# EAGLE design comperator_3dprinterV2 (EAGLE 8.3.0)
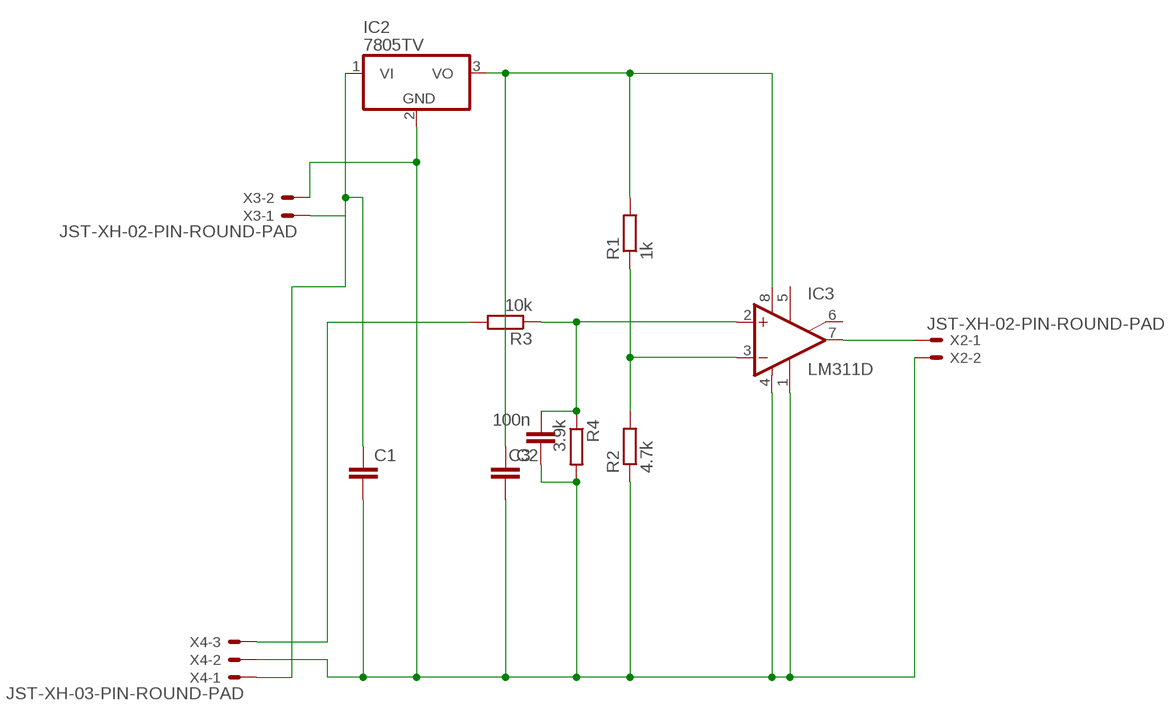
[diagram p0: schematic, sheet 1]

## Parts
C1  C2.5/2  [C2.5-2]
C2  C2.5/2  [C2.5-2]
C3  100n  C2.5/2  [C2.5-2]
IC2  7805TV  [TO220V]
IC3  LM311D  [SO08]
R1  1k  R-EU_0207/7  [0207/7]
R2  4.7k  R-EU_0207/7  [0207/7]
R3  10k  R-EU_0207/7  [0207/7]
R4  3.9k  R-EU_0207/7  [0207/7]
X2  JST-XH-02-PIN-ROUND-PAD  [JST-XH-02-PACKAGE-ROUND-PAD]
X3  JST-XH-02-PIN-ROUND-PAD  [JST-XH-02-PACKAGE-ROUND-PAD]
X4  JST-XH-03-PIN-ROUND-PAD  [JST-XH-03-PACKAGE-ROUND-PAD]

## Nets
GND: C1.2 C2.2 C3.1 IC2.2(GND) IC3.1(GND) IC3.4(V-) R2.1 R4.2 X2.2 X3.2 X4.2
N$1: IC3.7(OUT) X2.1
N$3: R3.2 X4.3
N$4: C2.1 IC2.3(VO) IC3.8(V+) R1.2
N$5: C3.2 IC3.2(+IN) R3.1 R4.1
N$7: IC3.3(-IN) R1.1 R2.2
VCC: C1.1 IC2.1(VI) X3.1 X4.1
Unconnected: IC3.5(ON) IC3.6(ON/STR)

## Library data of the parts
C1-C3 = capacitor-wima:C: CAPACITOR naming: grid - package width
IC2 = linear:78*: Positive VOLTAGE REGULATOR Source: http://cache.national.com/ds/LM/LM78L05.pdf http://www.fairchildsemi.com/ds/LM/LM7805.pdf
IC3 = linear2:LM311: COMPARATOR
R1-R4 = resistor:R-EU_: RESISTOR, European symbol
X2 X3 = Rembrandt Electronics - JST XH Connectors v1-0:JST-XH-02-PIN: JST XH Connector 2 Pin Wire to board connector. Pitch: 2,54 mm, (0.100") Number of pins: 2 Created by Rembrandt Electronics www.rembrandtelectronics.com
X4 = Rembrandt:JST-XH-03-PIN: JST XH Connector 2 Pin Wire to board connector. Pitch: 2,54 mm, (0.100") Number of pins: 3 Created by Rembrandt Electronics www.rembrandtelectronics.com

## Board
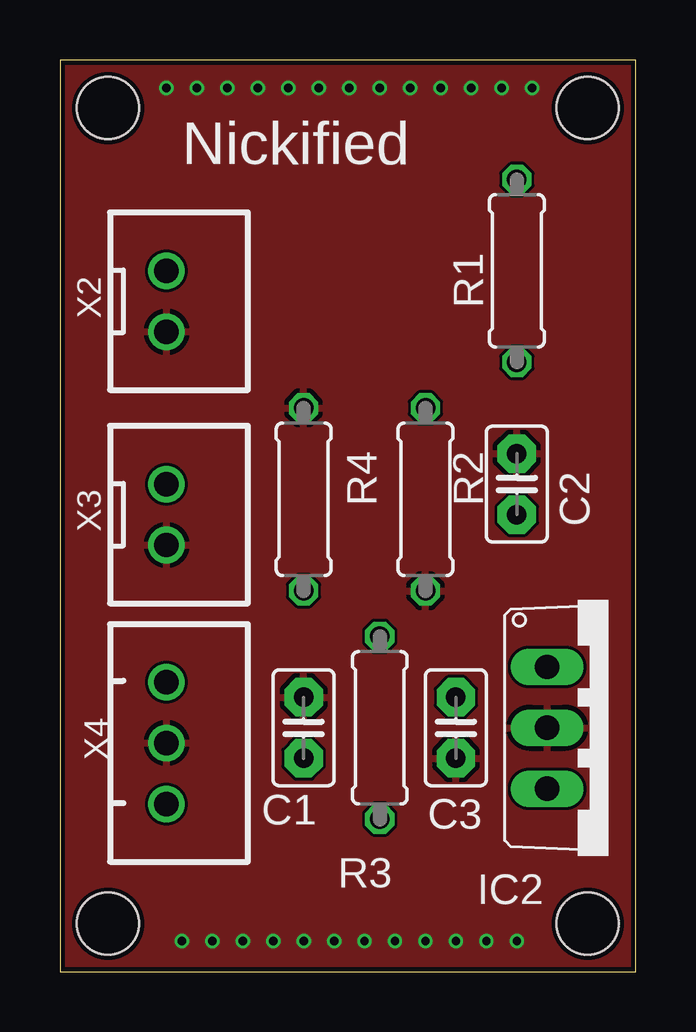
[diagram p1: board, top side]
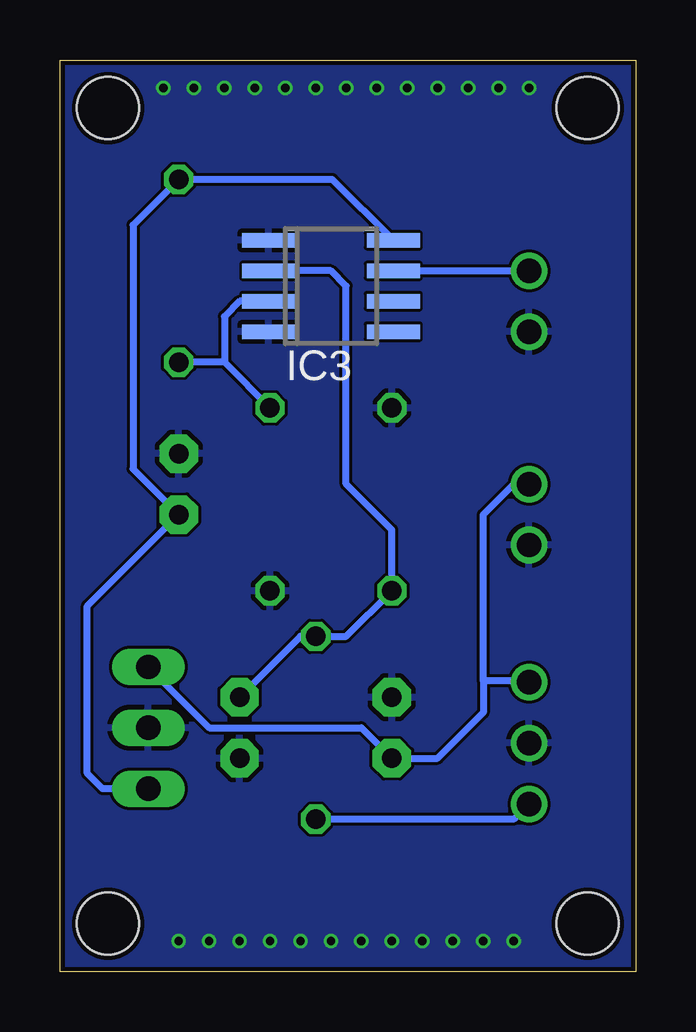
[diagram p2: board, bottom side, seen from below]

Size 24 x 38 mm. Coordinates in mm from the lower left corner, seen from the top.
Outline: 0,0 24,0 24,38 0,38 0,0
Copper layers (1*16): Top 0.018mm / dielectric 1.55mm / Bottom 0.018mm
Design rules "Multi-CB_2L_125um-Tracks_OL35um": minimum track width 0.125mm, minimum drill 0.2mm, track to track 0.125mm, track to pad 0.125mm, pad to pad 0.125mm, via to via 0.125mm, smd to smd 0mil, copper to edge 0.2mm, drill to drill 0.2mm, minimum pad ring 0.125mm, minimum via ring 0.125mm, stop-mask expansion 2mil, vias tented up to drill 0.45mm, thermal gap 0.2mm
Holes 2.6 mm at 2,36 22,36 22,2 2,2

### Footprints (pad centres in the part's own frame; a part is rotated, then mirrored left to right if it is on the bottom)
C2.5-2 = drill 0.813 pad 1.6 octagon: 1 -1.27,0; 2 1.27,0
TO220V = drill 1.016 long: 1 -2.54,-2.54; 2 0,-2.54; 3 2.54,-2.54
SO08 = smd 0.6 x 2.2: 1 -1.905,-2.6; 2 -0.635,-2.6; 3 0.635,-2.6; 4 1.905,-2.6; 5 1.905,2.6; 6 0.635,2.6; 7 -0.635,2.6; 8 -1.905,2.6
0207/7 = drill 0.813 octagon: 1 -3.81,0; 2 3.81,0
JST-XH-02-PACKAGE-ROUND-PAD = drill 1.016: 1 -1.27,0; 2 1.27,0
JST-XH-03-PACKAGE-ROUND-PAD = drill 1.016: 1 -2.54,0; 2 0,0; 3 2.54,0

### Placement (x,y rotation side)
C1  10.16,10.16 90 top
C2  19.05,20.32 90 top
C3  16.51,10.16 90 top
IC2  22.86,10.16 270 top
IC3  12.7,28.57 270 bottom
R1  19.05,29.21 90 top
R2  15.24,19.68 90 top
R3  13.34,10.16 270 top
R4  10.16,19.68 90 top
X2  4.45,27.94 270 top
X3  4.45,19.05 270 top
X4  4.45,9.53 270 top

### Tracks (layer width: path | path; a pad name or v marks a point on that pad's centre or on a via)
GND  (via drill 0.35)
  other vias: 5.08,1.27 6.35,1.27 7.62,1.27 8.89,1.27 10.16,1.27 11.43,1.27 12.7,1.27 13.97,1.27 15.24,1.27 16.51,1.27 17.78,1.27 19.05,1.27 19.68,36.83 18.41,36.83 17.14,36.83 15.88,36.83 14.61,36.83 13.34,36.83 12.06,36.83 10.79,36.83 9.53,36.83 8.26,36.83 6.99,36.83 5.71,36.83 4.45,36.83
  pour Bottom: -0.91,-0.45 24.91,-0.45 24.91,39.08 -0.91,39.08
  pour Top: -1.27,40.01 25.4,40.01 25.4,-0.64 -1.27,-0.64
N$1
  Bottom 0.3: IC3.7 X2.1
N$3
  Bottom 0.3: X4.3 5.08,6.35 R3.2
N$4
  Bottom 0.3: IC3.8 12.64,33.02 R1.2 20.95,31.11 20.95,20.95 C2.1 22.86,15.24 22.86,8.26 22.23,7.62 IC2.3 21.59,7.62
N$5
  Bottom 0.3: C3.2 13.97,13.97 R3.1 | R3.1 12.7,13.97 | IC3.2 12.7,29.21 12.06,28.57 12.06,20.32 10.16,18.41 R4.1 12.06,13.97 R3.1
N$7
  Bottom 0.3: 17.14,25.4 R2.2 | 17.14,25.4 R1.1 | IC3.3 16.51,27.94 17.14,27.3 17.14,25.4
VCC
  Bottom 0.3: X3.1 5.08,20.32 6.35,19.05 6.35,12.12 | 6.35,12.12 6.35,10.79 8.26,8.89 C1.1 11.43,10.16 17.78,10.16 IC2.1 | X4.1 4.5,12.12 6.35,12.12

### Text on the board
tNames: Nickified